# Altium schematic sheet system controller.SchDoc: 004-H-01 SD data logger
size A3; Organization: Sunflare Solar Team; Address1: Drachten; Address2: The Netherlands; Revision: V1.00; SheetNumber: 1; SheetTotal: 1
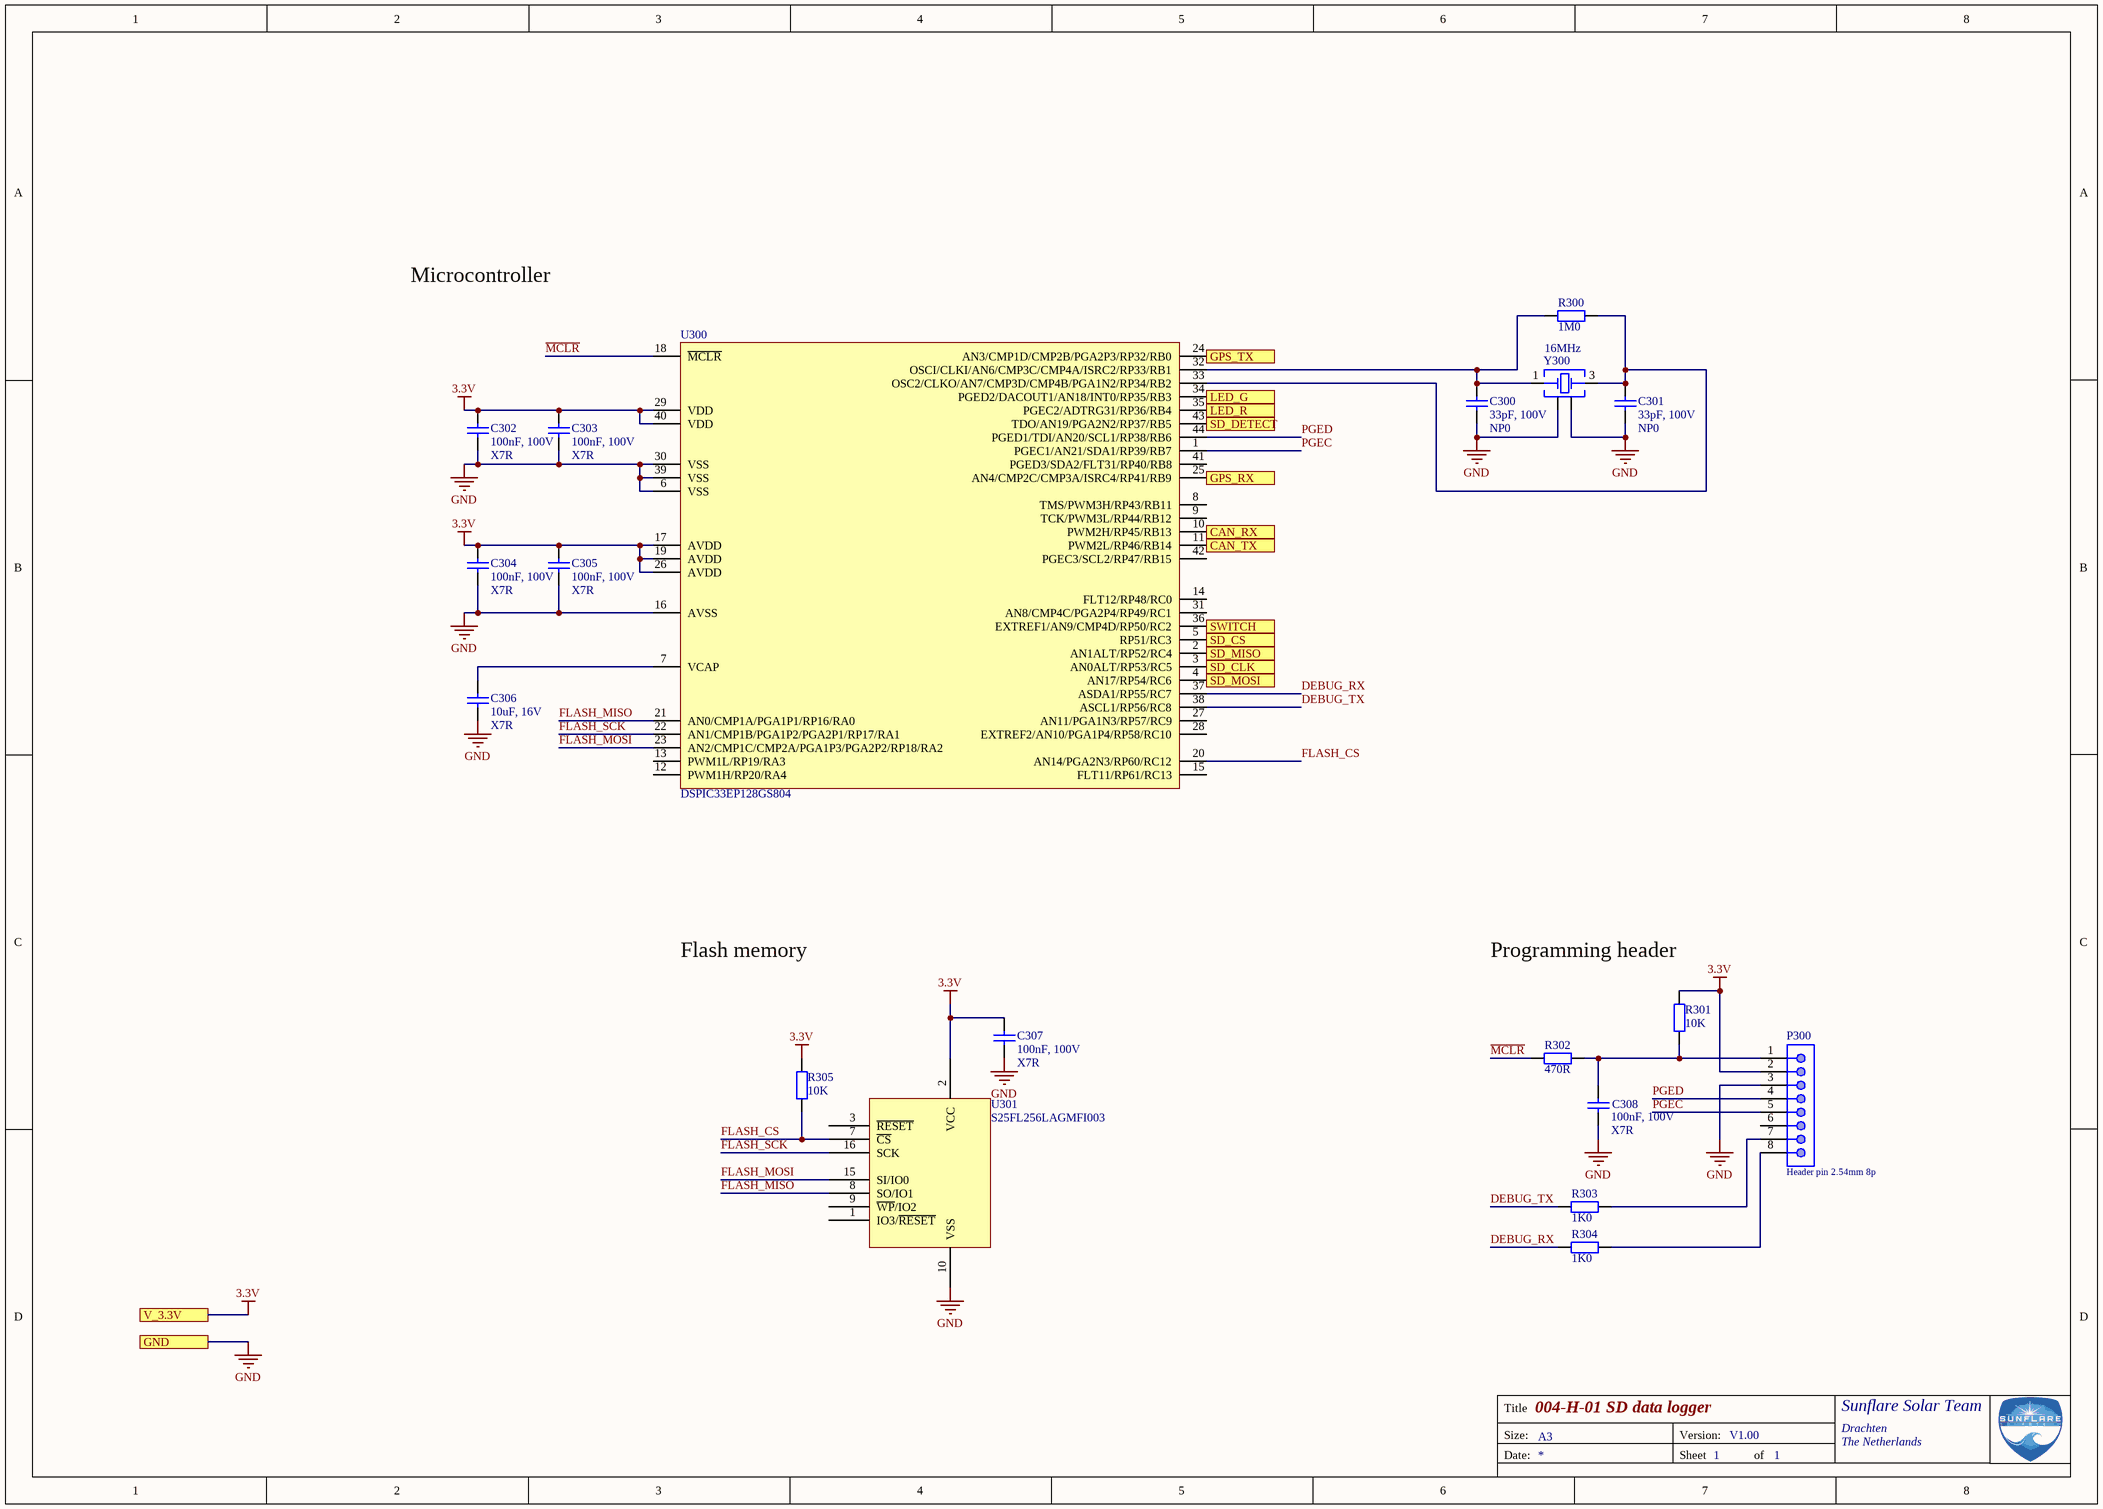
[diagram p0: system controller.SchDoc]

## Parts
C300  33pF, 100V  Ceramic Type: NP0  [CAP_0805]
C301  33pF, 100V  Ceramic Type: NP0  [CAP_0805]
C302  100nF, 100V  Ceramic Type: X7R  [CAP_0805]
C303  100nF, 100V  Ceramic Type: X7R  [CAP_0805]
C304  100nF, 100V  Ceramic Type: X7R  [CAP_0805]
C305  100nF, 100V  Ceramic Type: X7R  [CAP_0805]
C306  10uF, 16V  Ceramic Type: X7R  [CAP_1210]
C307  100nF, 100V  Ceramic Type: X7R  [CAP_0805]
C308  100nF, 100V  Ceramic Type: X7R  [CAP_0805]
P300  Header pin 2.54mm 8p  [WE-61300811121]
R300  1M0  [RES_0805]
R301  10K  [RES_0805]
R302  470R  [RES_0805]
R303  1K0  [RES_0805]
R304  1K0  [RES_0805]
R305  10K  [RES_0805]
U300  DSPIC33EP128GS804  [TQFP80P1200X1200X120-44N]
U301  S25FL256LAGMFI003  [SOIC127P1030X265-16N]
Y300  16MHz  [WE-XTAL_12SMX]

## Ports
CAN_RX, CAN_TX, GND, GPS_RX, GPS_TX, LED_G, LED_R, SD_CLK, SD_CS, SD_DETECT, SD_MISO, SD_MOSI, SWITCH, V_3.3V

## Nets
3.3V: C302.2 C303.2 C304.2 C305.2 C307.2 P300.2 R301.2 R305.2 U300.17(AVDD) U300.19(AVDD) U300.26(AVDD) U300.29(VDD) U300.40(VDD) U301.2(VCC) ; port V_3.3V
GND: C300.1 C301.1 C302.1 C303.1 C304.1 C305.1 C306.1 C307.1 C308.1 P300.3 U300.6(VSS) U300.16(AVSS) U300.30(VSS) U300.39(VSS) U301.10(VSS) Y300.2(GND_&_Lid) Y300.4(GND_&_Lid) ; port GND
CAN_RX: U300.10(PWM2H/RP45/RB13) ; port CAN_RX
CAN_TX: U300.11(PWM2L/RP46/RB14) ; port CAN_TX
DEBUG_RX: R304.1 U300.37(ASDA1/RP55/RC7)
DEBUG_TX: R303.1 U300.38(ASCL1/RP56/RC8)
FLASH_CS: R305.1 U300.20(AN14/PGA2N3/RP60/RC12) U301.7(~{CS})
FLASH_MISO: U300.21(AN0/CMP1A/PGA1P1/RP16/RA0) U301.8(SO/IO1)
FLASH_MOSI: U300.23(AN2/CMP1C/CMP2A/PGA1P3/PGA2P2/RP18/RA2) U301.15(SI/IO0)
FLASH_SCK: U300.22(AN1/CMP1B/PGA1P2/PGA2P1/RP17/RA1) U301.16(SCK)
GPS_RX: U300.25(AN4/CMP2C/CMP3A/ISRC4/RP41/RB9) ; port GPS_RX
GPS_TX: U300.24(AN3/CMP1D/CMP2B/PGA2P3/RP32/RB0) ; port GPS_TX
LED_G: U300.34(PGED2/DACOUT1/AN18/INT0/RP35/RB3) ; port LED_G
LED_R: U300.35(PGEC2/ADTRG31/RP36/RB4) ; port LED_R
~{MCLR}: R302.1 U300.18(~{MCLR})
PGEC: P300.5 U300.1(PGEC1/AN21/SDA1/RP39/RB7)
PGED: P300.4 U300.44(PGED1/TDI/AN20/SCL1/RP38/RB6)
SD_CLK: U300.3(AN0ALT/RP53/RC5) ; port SD_CLK
SD_CS: U300.5(RP51/RC3) ; port SD_CS
SD_DETECT: U300.43(TDO/AN19/PGA2N2/RP37/RB5) ; port SD_DETECT
SD_MISO: U300.2(AN1ALT/RP52/RC4) ; port SD_MISO
SD_MOSI: U300.4(AN17/RP54/RC6) ; port SD_MOSI
SWITCH: U300.36(EXTREF1/AN9/CMP4D/RP50/RC2) ; port SWITCH
NetC300_2: C300.2 R300.1 U300.32(OSCI/CLKI/AN6/CMP3C/CMP4A/ISRC2/RP33/RB1) Y300.1(Crystal)
NetC301_2: C301.2 R300.2 U300.33(OSC2/CLKO/AN7/CMP3D/CMP4B/PGA1N2/RP34/RB2) Y300.3(Crystal)
NetC306_2: C306.2 U300.7(VCAP)
NetC308_2: C308.2 P300.1 R301.1 R302.2
NetP300_7: P300.7 R303.2
NetP300_8: P300.8 R304.2

Not connected (* = marked no-connect by the designer): P300 6; U300 8(TMS/PWM3H/RP43/RB11) 9(TCK/PWM3L/RP44/RB12) 12(PWM1H/RP20/RA4) 13(PWM1L/RP19/RA3) 14(FLT12/RP48/RC0) 15(FLT11/RP61/RC13) 27(AN11/PGA1N3/RP57/RC9) 28(EXTREF2/AN10/PGA1P4/RP58/RC10) 31(AN8/CMP4C/PGA2P4/RP49/RC1) 41(PGED3/SDA2/FLT31/RP40/RB8) 42(PGEC3/SCL2/RP47/RB15); U301 1(IO3/~{RESET}) 3(~{RESET}) 9(~{WP}/IO2)

## Notes on the sheet
- Microcontroller
- Flash memory
- (near R301) Programming header
- Title
- Size:
- Date:
- A3
- Version:
- Sheet
- of

## Library data of the parts
C300 C301 = CAP_0805_33pF_100V: WCAP-CSGP Multilayer Ceramic Chip Capacitor, General Purpose, size 0805, NP0, 33pF, 100V; Manufacturer Part Number: 885012007079; Manufacturer: Wurth Elektronik; Rated Voltage: 100VDC; Isolation Resistance: >=10GOhm; Capacitance Tolerance: +/-5%; Dissipation Factor: Q>=1000; Technical Reference: NP00805330J100DFCT10000; ComponentLink1Description: Manufacturer; ComponentLink1URL: http://www.we-online.de; ComponentLink2Description: Datasheet; ComponentLink2URL: https://www.we-online.com/catalog/datasheet/885012007079.pdf; Operating Temperature: -55 to +125degC; Packaging: Tape and Reel; Published Date: May 2020; Height: 0.6mm; Mounting Technology: SMT; Size: 0805; Capacitance: 33pF
C302-C305 C307 C308 = CAP_0805_100nF_100V: WCAP-CSGP Multilayer Ceramic Chip Capacitor, General Purpose, size 0805, X7R, 100nF, 100V; Manufacturer Part Number: 885012207128; Manufacturer: Wurth Elektronik; Rated Voltage: 100VDC; Isolation Resistance: >=1GOhm; Capacitance Tolerance: +/-10%; Technical Reference: X7R0805104K100DFCT10000; ComponentLink1Description: Manufacturer; ComponentLink1URL: http://www.we-online.de; ComponentLink2Description: Datasheet; ComponentLink2URL: https://www.we-online.com/catalog/datasheet/885012207128.pdf; Operating Temperature: -55 to +125degC; Packaging: Tape and Reel; Published Date: May 2020; Dissipation Factor: =<2.5%; Height: 1.25mm; Mounting Technology: SMT; Size: 0805; Capacitance: 100nF; Supplier 1: Farnell; Supplier Part Number 1: 2812440
C306 = CAP_1210_10uF_16V: WCAP-CSGP Multilayer Ceramic Chip Capacitor, General Purpose, size 1210, X7R, 10uF, 16V; Manufacturer Part Number: 885012209014; Manufacturer: Wurth Elektronik; Rated Voltage: 16VDC; Isolation Resistance: >=0.1GOhm; Capacitance Tolerance: +/-10%; Technical Reference: X7R1210106K016DFCT10000; ComponentLink1Description: Manufacturer; ComponentLink1URL: http://www.we-online.de; ComponentLink2Description: Datasheet; ComponentLink2URL: https://www.we-online.com/catalog/datasheet/885012209014.pdf; Operating Temperature: -55 to +125degC; Packaging: Tape and Reel; Published Date: May 2020; Dissipation Factor: =<5%; Height: 2mm; Mounting Technology: SMT; Size: 1210; Capacitance: 10uF
P300 = Header pin 2.54mm 8p: WR-PHD Pin Header, THT, pitch 2.54mm, Single Row, Vertical, 8p; Manufacturer Part Number: 61300811121; Manufacturer: Wurth Elektronik; Pin Number: 8; Rated Current: 3A; Working Voltage: 250VAC; Withstanding Voltage: 500VAC; Contact Resistance: 20mOhm; ComponentLink1Description: Manufacturer; ComponentLink1URL: http://www.we-online.de; ComponentLink2Description: Datasheet; ComponentLink2URL: https://www.we-online.com/catalog/datasheet/61300811121.pdf; Published Date: May 2020; Pitch: 2.54mm; Operating Temperature: -40 to +105degC; Mounting Technology: THT; Packaging: Bag; Gender: Pin Header; Row Number: Single; Orientation: Vertical; Supplier 1: Farnell; Supplier Part Number 1: 2356160
R300 = RES_0805_1M0: Thick Film Resistor, size 0805, 1%; Rated Power: 0.125W; Resistance Tolerance: +/-1%; Resistance: 1M0; Height: 0.6mm; Operating Temperature: -55 to +155degC; Mounting Technology: SMT; Packaging: Tape and Reel; Size: 0805; Length: 2mm; Width: 1.25mm
R301 R305 = RES_0805_10K: Thick Film Resistor, size 0805, 1%; Rated Power: 0.125W; Resistance Tolerance: +/-1%; Resistance: 10K; Height: 0.6mm; Operating Temperature: -55 to +155degC; Mounting Technology: SMT; Packaging: Tape and Reel; Size: 0805; Length: 2mm; Width: 1.25mm
R302 = RES_0805_470R: Thick Film Resistor, size 0805, 1%; Rated Power: 0.125W; Resistance Tolerance: +/-1%; Resistance: 470R; Height: 0.6mm; Operating Temperature: -55 to +155degC; Mounting Technology: SMT; Packaging: Tape and Reel; Size: 0805; Length: 2mm; Width: 1.25mm
R303 R304 = RES_0805_1K0: Thick Film Resistor, size 0805, 1%; Rated Power: 0.125W; Resistance Tolerance: +/-1%; Resistance: 1K0; Height: 0.6mm; Operating Temperature: -55 to +155degC; Mounting Technology: SMT; Packaging: Tape and Reel; Size: 0805; Length: 2mm; Width: 1.25mm
U300 = DSPIC33EP128GS804: 16-Bit Digital Signal Controllers fo  r Digital Power Applications with   Interconnected High-Speed PWM, ADC, PGA and Comparators; Manufacturer: Microchip; Manufacturer Part No: DSPIC33EP128GS804-I/PT; Supplier 1: Farnell; Supplier Part Number 1: 2706170
U301 = S25FL256LAGMFI003: Flash Memory, Floating Gate Architecture, Serial NOR, 256 Mbit, 32M x 8bit, SPI, WSOIC, 16 Pins; Manufacturer: Cypress - Infineon Technologies; Manufacturer Part No: S25FL256LAGMFI003; Supplier 1: Farnell; Supplier Part Number 1: 2768046
Y300 = Crystal_16MHz: WE-XTAL Quartz Crystal, SMT, 12SMX, 16MHz, +/-30ppm; Manufacturer Part Number: 830026392; Manufacturer: Wurth Elektronik; Frequency Stability: +/-50ppm; Load Capacitance: 16pF; ComponentLink1Description: Manufacturer; ComponentLink1URL: http://www.we-online.de; ComponentLink2Description: Datasheet; ComponentLink2URL: https://katalog.we-online.com/pbs/datasheet/830026392.pdf; Operating Temperature: -20 to +70degC; Packaging: Tape and Reel; Published Date: July 2020; Size: 12SMX; Frequency: 16MHz; Frequency Tolerance: +/-30ppm; Mounting Technology: SMT